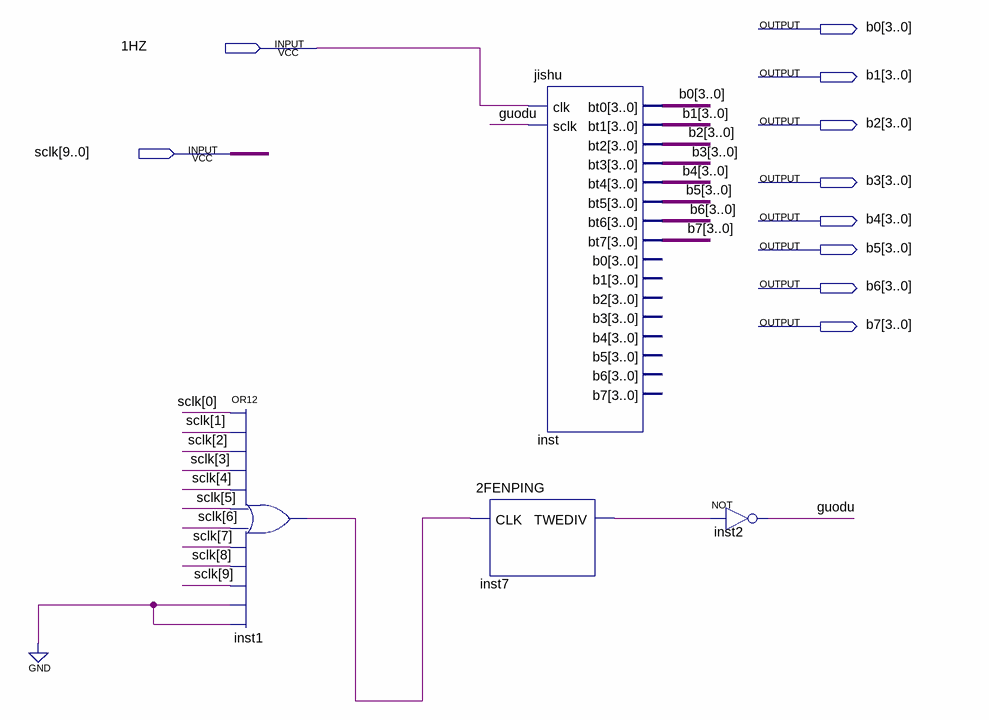
[diagram p0: schematic sheet]
// Quartus schematic gaijin.bdf as structural Verilog: 4 symbols, 10 pins
module gaijin (
  input  \1HZ ,
  input  [9:0] sclk,
  output [3:0] b0,
  output [3:0] b1,
  output [3:0] b2,
  output [3:0] b3,
  output [3:0] b4,
  output [3:0] b5,
  output [3:0] b6,
  output [3:0] b7
);

  wire guodu, inst1_out, inst7_twediv;

  or inst1 (inst1_out, sclk[0], sclk[1], sclk[2], sclk[3], sclk[4], sclk[5], sclk[6], sclk[7], sclk[8], sclk[9], 1'b0, 1'b0);
  \2FENPING  inst7 (.CLK(inst1_out), .TWEDIV(inst7_twediv));
  jishu inst (
    .clk(\1HZ ), .sclk(guodu), .bt0(b0), .bt1(b1), .bt2(b2), .bt3(b3), .bt4(b4), .bt5(b5), .bt6(b6), .bt7(b7));  // open: b0, b1, b2, b3, b4, b5, b6, b7
  not inst2 (guodu, inst7_twediv);
endmodule
